# EAGLE design attiny2313devbdtst1 (EAGLE 5.06)
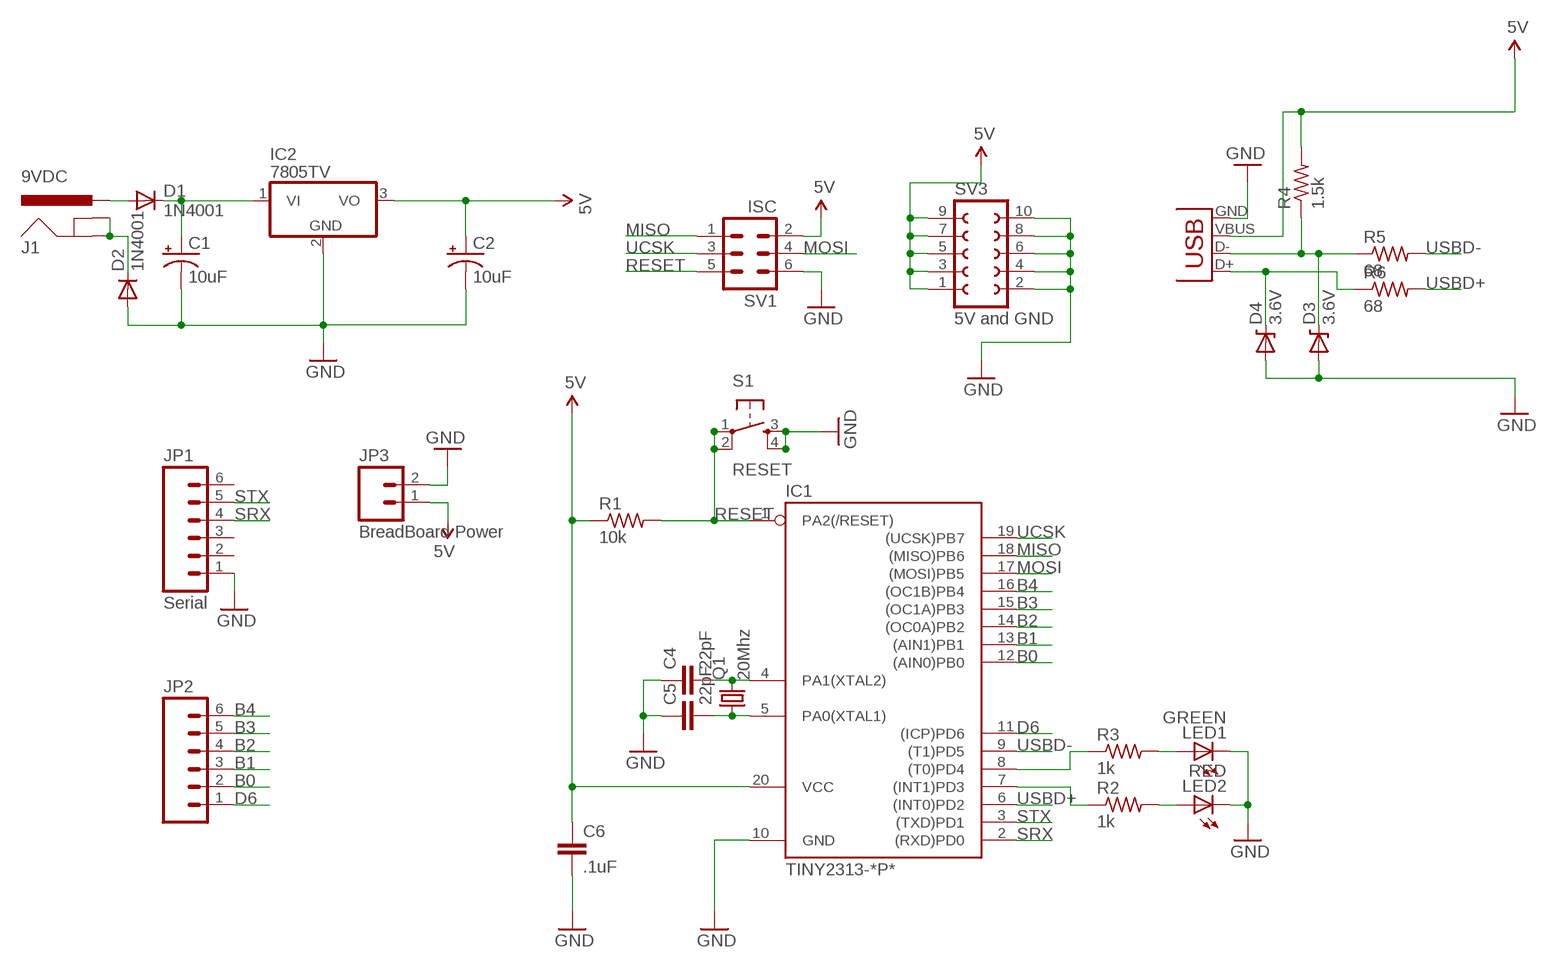
[diagram p0: schematic, sheet 1]

## Parts
C1  10uF  CAP_POLPTH2  [CPOL-RADIAL-10UF-25V]
C2  10uF  CAP_POLPTH2  [CPOL-RADIAL-10UF-25V]
C4  22pF  CAPPTH2  [CAP-PTH-SMALL2]
C5  22pF  CAPPTH2  [CAP-PTH-SMALL2]
C6  .1uF  CAPPTH2  [CAP-PTH-SMALL2]
D1  1N4001  DIODEPTH  [DIODE-1N4001]
D2  1N4001  DIODEPTH  [DIODE-1N4001]
D3  3.6V  DIODE-ZENERPTH  [DIODE-ZENER]
D4  3.6V  DIODE-ZENERPTH  [DIODE-ZENER]
IC1  TINY2313-*P*  [DIL20]
IC2  7805TV  [TO220V]
J1  9VDC  POWER_JACKPTH  [POWER_JACK_PTH]
JP1  Serial  M06SIP  [1X06]
JP2  M06SIP  [1X06]
JP3  BreadBoard Power  M02PTH  [1X02]
LED1  GREEN  LED3MM  [LED3MM]
LED2  RED  LED3MM  [LED3MM]
Q1  20Mhz  CRYSTALHC49UV  [HC49U-V]
R1  10k  R-US_0207/10  [0207/10]
R2  1k  R-US_0207/10  [0207/10]
R3  1k  R-US_0207/10  [0207/10]
R4  1.5k  R-US_0207/10  [0207/10]
R5  68  R-US_0207/10  [0207/10]
R6  68  R-US_0207/10  [0207/10]
S1  RESET  TAC_SWITCHPTH  [TACTILE-PTH]
SV1  ISC  ML6  [ML6]
SV3  5V and GND  FE05-2  [FE05-2]
X1  USBPTH  [USB-B-PTH]

## Nets
5V [5V]: C2.1(+) C6.1 IC1.20(VCC) IC2.3(VO) JP3.1 R1.1 R4.2 SV1.2 SV3.1 SV3.3 SV3.5 SV3.7 SV3.9 X1.VBUS
B0: IC1.12((AIN0)PB0) JP2.2
B1: IC1.13((AIN1)PB1) JP2.3
B2: IC1.14((OC0A)PB2) JP2.4
B3: IC1.15((OC1A)PB3) JP2.5
B4: IC1.16((OC1B)PB4) JP2.6
D6: IC1.11((ICP)PD6) JP2.1
GND [GND]: C1.2(-) C2.2(-) C4.1 C5.1 C6.2 D2.A D3.P$2(A) D4.P$2(A) IC1.10(GND) IC2.2(GND) JP1.1 JP3.2 LED1.K(C) LED2.K(C) S1.3 S1.4 SV1.6 SV3.2 SV3.4 SV3.6 SV3.8 SV3.10 X1.GND
MISO: IC1.18((MISO)PB6) SV1.1
MOSI: IC1.17((MOSI)PB5) SV1.4
N$1: D1.A J1.PWR
N$2: C1.1(+) D1.C IC2.1(VI)
N$3: D2.C J1.GND J1.GNDBREAK
N$4: IC1.8((T0)PD4) R3.1
N$5: IC1.7((INT1)PD3) R2.1
N$6: C4.2 IC1.4(PA1(XTAL2)) Q1.2
N$7: C5.2 IC1.5(PA0(XTAL1)) Q1.1
N$8: LED2.A R2.2
N$9: LED1.A R3.2
N$10: D3.P$1(C) R4.1 R5.1 X1.D-
N$11: D4.P$1(C) R6.1 X1.D+
RESET: IC1.1(PA2(/RESET)) R1.2 S1.1 S1.2 SV1.5
SRX: IC1.2((RXD)PD0) JP1.4
STX: IC1.3((TXD)PD1) JP1.5
UCSK: IC1.19((UCSK)PB7) SV1.3
USBD+: IC1.6((INT0)PD2) R6.2
USBD-: IC1.9((T1)PD5) R5.2
Unconnected: JP1.2 JP1.3 JP1.6

## Library data of the parts
C1 C2 = SparkFun:CAP_POL: Capacitor Polarized These are standard SMD and PTH capacitors. Normally 10uF, 47uF, and 100uF in electrolytic and tantalum varieties. Always verify the external diameter of the through hole cap, it varies with capacity, voltage, and manufacturer. The EIA devices should be standard.
C4-C6 = SparkFun:CAP: Capacitor Standard 0603 ceramic capacitor, and 0.1" leaded capacitor.
D1 D2 = SparkFun:DIODE: Diode These are standard reverse protection diodes and small signal diodes. SMA package can handle up to about 1A. SOD-323 can handle about 200mA. What the SOD-323 package when ordering, there are some mfgs out there that are 5-pin packages.
D3 D4 = SparkFun:DIODE-ZENER: Zener Diode Production Part - 8199 3.4V Zener Voltage
IC1 = avr-6:TINY2313*: Atmel Tiny2313 2K Flash, 128 bytes EEPROM, 128 bytes RAM
IC2 = linear:78*: Positive VOLTAGE REGULATOR Source: http://cache.national.com/ds/LM/LM78L05.pdf http://www.fairchildsemi.com/ds/LM/LM7805.pdf
J1 = SparkFun:POWER_JACK: Power Jack This is the standard 5.5mm barrel jack for power. The PTH is the most common, proven, reliable, footprint. All others are experimental. The Slot footprint only works if the mill layer is transmitted to the PCB fab house so be warned. Spark Fun Electronics SKU : PRT-00119. Mating wall wart : TOL-00298 (and others)
JP1 JP2 = SparkFun:M06: Header 6 Standard 6-pin 0.1" header. Use with straight break away headers (SKU : PRT-00116), right angle break away headers (PRT-00553), swiss pins (PRT-00743), machine pins (PRT-00117), and female headers (PRT-00115). Molex polarized connector foot print use with SKU : PRT-08094 with associated crimp pins and housings. NOTES ON THE VARIANTS LOCK and LOCK_LONGPADS... This footprint was designed to help hold the alignment of a through-hole component (i.e. 6-pin header) while soldering it into place. You may notice that each hole has been shifted either up or down by 0.005 of an inch from it's more standard position (which is a perfectly straight line). This slight alteration caused the pins (the squares in the middle) to touch the edges of the holes. Because they are alternating, it causes a "brace" to hold the component in place. 0.005 has proven to be the perfect amount of "off-center" position when using our standard breakaway headers. Although looks a little odd when you look at the bare footprint, once you have a header in there, the alteration is very hard to notice. Also, if you push a header all the way into place, it is covered up entirely on the bottom side. This idea of altering the position of holes to aid alignment will be further integrated into the Sparkfun Library for other footprints. It can help hold any component with 3 or more connection pins.
JP3 = SparkFun:M02: Header 2 Standard 2-pin 0.1" header. Use with straight break away headers (SKU : PRT-00116), right angle break away headers (PRT-00553), swiss pins (PRT-00743), machine pins (PRT-00117), and female headers (PRT-00115). Molex polarized connector foot print use with SKU : PRT-08233 with associated crimp pins and housings.
LED1 LED2 = SparkFun:LED: LEDs Standard schematic elements and footprints for 5mm, 3mm, 1206, and 0603 sized LEDs. 5mm - Spark Fun Electronics SKU : COM-00529 (and others)
Q1 = SparkFun:CRYSTAL: Crystals Various standard crystals. Proven footprints. Spark Fun Electronics SKU : COM-00534
R1-R6 = resistor:R-US_: RESISTOR, American symbol
S1 = SparkFun:TAC_SWITCH: Momentary Switch Button commonly used for reset or general input. Spark Fun Electronics SKU : COM-00097
SV1 = con-harting-ml:ML6: HARTING
SV3 = con-lsta:FE05-2: FEMALE HEADER
X1 = SparkFun:USB: USB Connectors USB-B-PTH is fully proven SKU : PRT-00139 USB-miniB is fully proven SKU : PRT-00587 USB-A-PCB is untested. USB-A-H is throughly reviewed, but untested. Spark Fun Electronics SKU : PRT-00437 USB-B-SMT is throughly reviewed, but untested. Needs silkscreen touching up. USB-A-S has not been used/tested USB-MB-H has not been used/tested

## Net classes
1 5V: width 0.012 mm
2 GND: width 0.012 mm

## Board
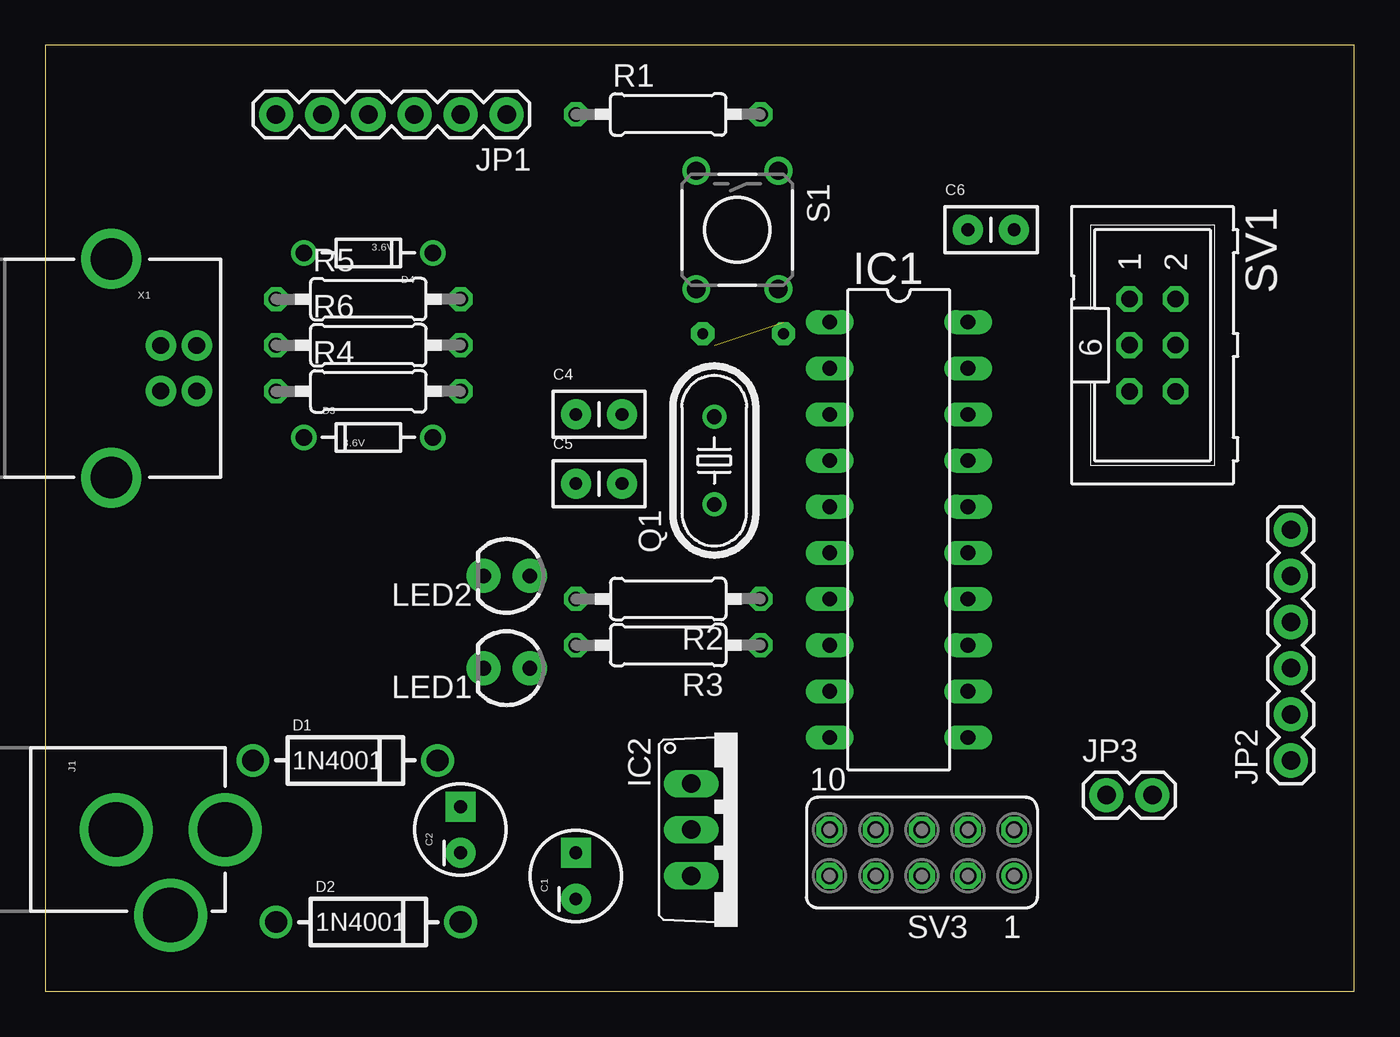
[diagram p1: board, top side]
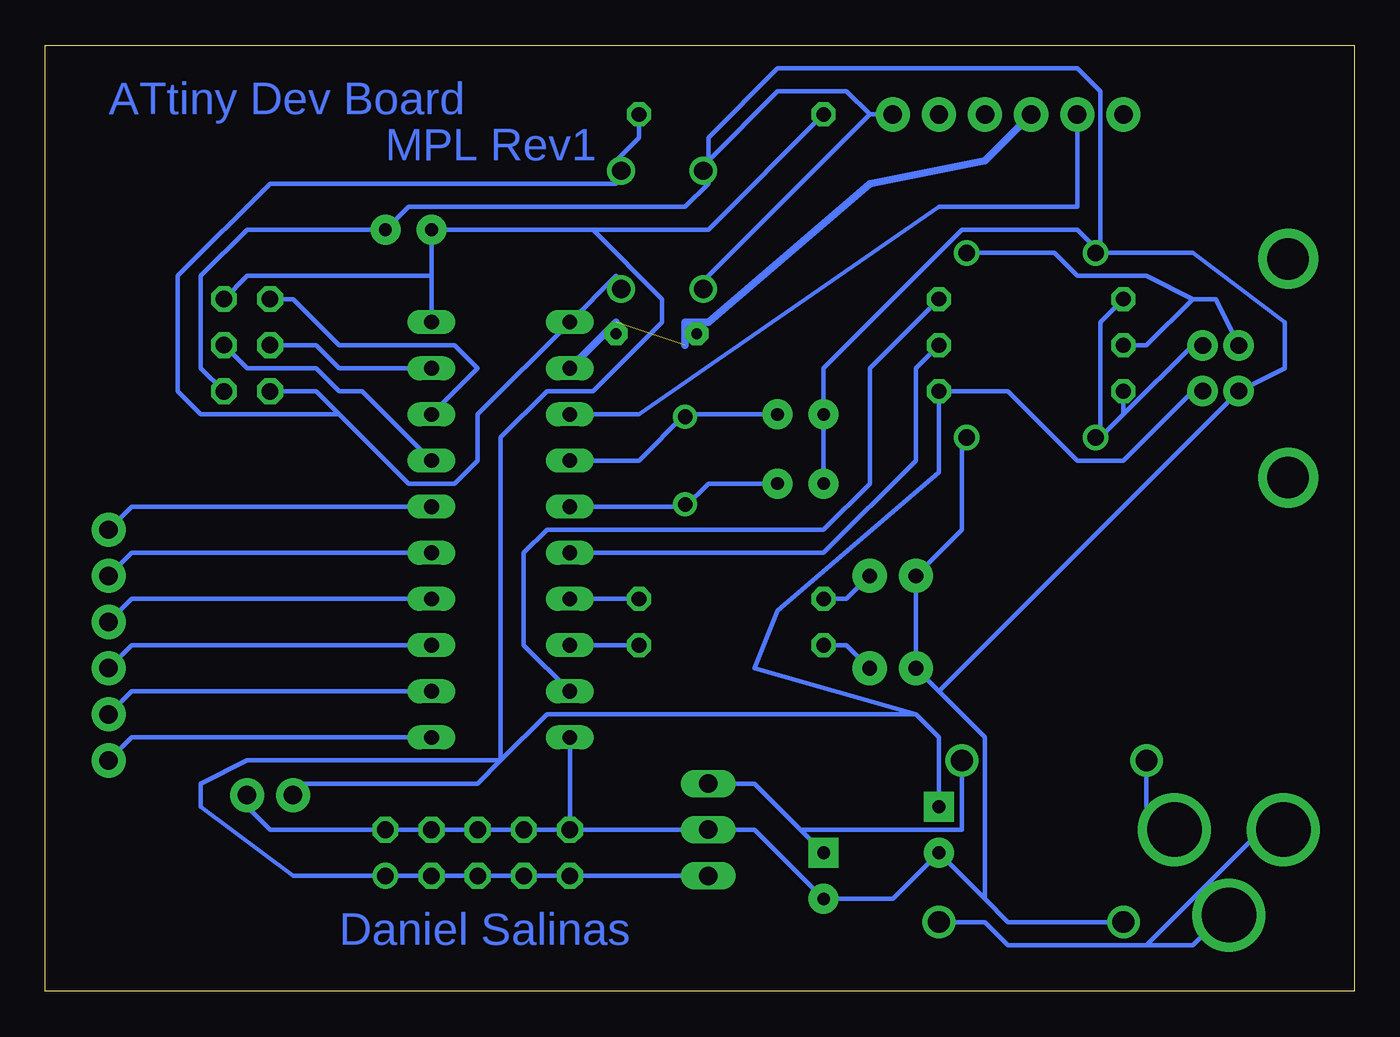
[diagram p2: board, bottom side, seen from below]

Size 72.06 x 52.06 mm. Coordinates in mm from the lower left corner, seen from the top.
Outline: 0,0 72.06,0 72.06,52.06 0,52.06 0,0
Copper layers (1*16): Top 0.035mm / dielectric 1.5mm / Bottom 0.035mm
Design rules "default *": minimum track width 10mil, minimum drill 24mil, track to track 8mil, track to pad 8mil, pad to pad 8mil, via to via 8mil, smd to smd 8mil, copper to edge 40mil, drill to drill 8mil, minimum pad ring 10mil, minimum via ring 8mil, stop-mask expansion 4mil, vias tented up to drill 0mil, thermal gap 10mil

### Footprints (pad centres in the part's own frame; a part is rotated, then mirrored left to right if it is on the bottom)
CPOL-RADIAL-10UF-25V = drill 0.7 pad 1.651 square: 1 1.27,0 | drill 0.7 pad 1.651 round: 2 -1.27,0
CAP-PTH-SMALL2 = drill 0.7 pad 1.651 round: 1 0,0; 2 2.54,0
DIODE-1N4001 = drill 1.2 round: A -5.08,0; C 5.08,0
DIODE-ZENER = drill 0.9 round: P$1 -3.556,0; P$2 3.556,0
DIL20 = drill 0.813 long: 1 -11.43,-3.81; 2 -8.89,-3.81; 3 -6.35,-3.81; 4 -3.81,-3.81; 5 -1.27,-3.81; 6 1.27,-3.81; 7 3.81,-3.81; 8 6.35,-3.81; 9 8.89,-3.81; 10 11.43,-3.81; 11 11.43,3.81; 12 8.89,3.81; 13 6.35,3.81; 14 3.81,3.81; 15 1.27,3.81; 16 -1.27,3.81; 17 -3.81,3.81; 18 -6.35,3.81; 19 -8.89,3.81; 20 -11.43,3.81
TO220V = drill 1.016 long: 1 -2.54,-2.54; 2 0,-2.54; 3 2.54,-2.54
POWER_JACK_PTH = drill 2.997 round: GND 0,7.7; GNDBREAK 4.7,10.7; PWR 0,13.7
1X06 = drill 1.016 pad 1.88 round: 1 0,0; 2 2.54,0; 3 5.08,0; 4 7.62,0; 5 10.16,0; 6 12.7,0
1X02 = drill 1.016 pad 1.88 round: 1 0,0; 2 2.54,0
LED3MM = drill 0.813 pad 1.88 round: A -1.27,0; K 1.27,0
HC49U-V = drill 0.813 round: 1 -2.413,0; 2 2.413,0
0207/10 = drill 0.813 octagon: 1 -5.08,0; 2 5.08,0
TACTILE-PTH = drill 1.016 round: 1 -3.251,2.261; 2 3.251,2.261; 3 -3.251,-2.261; 4 3.251,-2.261
ML6 = drill 0.914 octagon: 1 -2.54,-1.27; 2 -2.54,1.27; 3 0,-1.27; 4 0,1.27; 5 2.54,-1.27; 6 2.54,1.27
FE05-2 = drill 0.914 round: 1 -5.08,1.27 | drill 0.914 octagon: 2 -5.08,-1.27; 3 -2.54,1.27; 4 -2.54,-1.27; 5 0,1.27; 6 0,-1.27; 7 2.54,1.27; 8 2.54,-1.27; 9 5.08,1.27; 10 5.08,-1.27
USB-B-PTH = drill 0.914 pad 1.676 round: D+ 0,1.25; D- 1.981,1.25; GND 0,-1.25; VBUS 1.981,-1.25 | drill 2.286 round: P$1 -2.718,-6.02; P$2 -2.718,6.02

### Placement (x,y rotation side)
C1  29.21,6.35 90 top
C2  22.86,8.89 90 top
C4  29.21,31.75 0 top
C5  29.21,27.94 0 top
C6  50.8,41.91 0 top
D1  16.51,12.7 0 top
D2  17.78,3.81 0 top
D3  17.78,30.48 0 top
D4  17.78,40.64 180 top
IC1  46.99,25.4 270 top
IC2  38.1,8.89 270 top
J1  -3.81,8.89 270 top
JP1  25.4,48.26 180 top
JP2  68.58,12.7 90 top
JP3  58.42,10.79 0 top
LED1  25.4,17.78 180 top
LED2  25.4,22.86 180 top
Q1  36.83,29.21 90 top
R1  34.29,48.26 0 top
R2  34.29,21.59 180 top
R3  34.29,19.05 180 top
R4  17.78,33.02 0 top
R5  17.78,38.1 0 top
R6  17.78,35.56 0 top
S1  38.1,41.91 270 top
SV1  60.96,35.56 270 top
SV3  48.26,7.62 180 top
X1  6.35,34.29 0 top

### Tracks (layer width: path | path; a pad name or v marks a point on that pad's centre or on a via)
5V
  Bottom 0.254: R1.1 35.56,41.91 41.91,41.91 | 41.91,41.91 C6.1 50.8,39.37 | 50.8,39.37 IC1.20 | SV1.2 60.96,39.37 50.8,39.37 | IC2.3 SV3.9 SV3.7 SV3.5 SV3.3 SV3.1 58.42,6.35 63.5,10.16 63.5,11.43 60.96,12.7 46.99,12.7 | X1.VBUS 8.89,33.02 12.7,29.21 15.24,29.21 19.05,33.02 R4.2 22.86,28.58 31.75,20.95 33.02,17.78 24.13,15.24 | C2.1 22.86,13.97 24.13,15.24 | 46.99,12.7 44.45,15.24 24.13,15.24 | 46.99,12.7 48.26,11.43 58.42,11.43 JP3.1 | 41.91,41.91 38.1,38.1 38.1,36.83 41.91,33.02 44.45,33.02 46.99,30.48 46.99,12.7
B0
  Bottom 0.254: IC1.12 67.31,16.51 JP2.2
B1
  Bottom 0.254: IC1.13 67.31,19.05 JP2.3
B2
  Bottom 0.254: IC1.14 67.31,21.59 JP2.4
B3
  Bottom 0.254: IC1.15 67.31,24.13 JP2.5
B4
  Bottom 0.254: IC1.16 67.31,26.67 JP2.6
D6
  Bottom 0.254: IC1.11 67.31,13.97 JP2.1
GND
  Bottom 0.254: SV1.6 63.5,34.29 63.5,39.37 60.96,41.91 C6.2 52.07,43.18 36.83,43.18 35.56,44.45 S1.3 35.56,45.72 | 26.67,48.26 35.56,39.37 S1.4 | 26.67,48.26 JP1.1 | 35.56,45.72 31.75,49.53 27.94,49.53 26.67,48.26 | C5.1 C4.1 29.21,34.29 21.59,41.91 15.24,41.91 13.97,40.64 | 13.97,40.64 8.89,40.64 3.81,36.83 3.81,34.29 6.35,33.02 | SV3.10 IC1.10 | SV3.10 SV3.8 SV3.6 SV3.4 SV3.2 59.69,8.89 60.96,10.16 JP3.2 | SV3.10 IC2.2 33.02,8.89 C1.2 25.4,5.08 C2.2 20.32,5.08 | D3.P$2 21.59,30.48 21.59,25.4 LED2.K LED1.K 22.86,16.51 | D2.A 19.05,3.81 20.32,5.08 | 22.86,16.51 20.32,13.97 20.32,5.08 | 22.86,16.51 6.35,33.02 | 6.35,33.02 X1.GND | 35.56,45.72 35.56,46.99 31.75,50.8 15.24,50.8 13.97,49.53 13.97,40.64 | 13.97,40.64 D4.P$2
MISO
  Bottom 0.254: IC1.18 48.26,34.29 49.53,35.56 55.88,35.56 58.42,38.1 SV1.1
MOSI
  Bottom 0.254: IC1.17 54.61,33.02 55.88,33.02 57.15,34.29 60.96,34.29 SV1.4
N$1
  Bottom 0.254: D1.A 11.43,10.16 10.16,8.89 J1.PWR
N$2
  Bottom 0.254: IC2.1 33.02,11.43 30.48,8.89 | 30.48,8.89 C1.1 | D1.C 21.59,8.89 30.48,8.89
N$3
  Bottom 0.254: D2.C 20.32,3.81 19.05,2.54 11.43,2.54 | 11.43,2.54 8.89,2.54 7.62,3.81 J1.GNDBREAK | 11.43,2.54 5.08,8.89 J1.GND
N$4
  Bottom 0.254: R3.1 IC1.8
N$5
  Bottom 0.254: R2.1 IC1.7
N$6
  Bottom 0.254: IC1.4 39.37,29.21 36.83,31.75 | C4.2 36.83,31.75 | 36.83,31.75 Q1.2
N$7
  Bottom 0.254: 36.83,26.67 IC1.5 | C5.2 35.56,27.94 36.83,26.67 | 36.83,26.67 Q1.1
N$8
  Bottom 0.254: R2.2 27.94,21.59 LED2.A
N$9
  Bottom 0.254: R3.2 27.94,19.05 LED1.A
N$10
  Bottom 0.254: 12.7,31.75 R4.1 | 13.97,30.48 12.7,31.75 | R5.1 13.97,36.83 13.97,30.48 | D3.P$1 13.97,30.48 | 12.7,31.75 8.89,35.56 X1.D-
N$11
  Bottom 0.254: R6.1 11.43,35.56 8.89,38.1 | 8.89,38.1 7.62,38.1 6.35,35.56 X1.D+ | 8.89,38.1 11.43,39.37 15.24,39.37 16.51,40.64 D4.P$1 21.59,40.64
N$12  (via drill 0.6 pad 1.27)
  other vias: 40.64,36.2
N$13  (via drill 0.6 pad 1.27)
  other vias: 36.19,36.2
RESET
  Bottom 0.254: R1.2 39.37,46.99 40.64,45.72 S1.1 40.64,44.45 59.69,44.45 64.77,39.37 64.77,33.02 63.5,31.75 55.88,31.75 | S1.2 40.64,39.37 IC1.1 48.26,31.75 48.26,29.21 49.53,27.94 52.07,27.94 55.88,31.75 | SV1.5 57.15,33.02 55.88,31.75
SRX  (1 unrouted)
  Bottom 0.406: JP1.4 20.32,45.72 26.67,44.45 35.56,36.83 36.83,36.83 36.83,35.56 | IC1.2 40.64,36.83
STX
  Bottom 0.254: IC1.3 39.37,31.75 22.86,43.18 15.24,43.18 JP1.5
UCSK
  Bottom 0.254: IC1.19 55.88,34.29 57.15,35.56 SV1.3
USBD+
  Bottom 0.254: IC1.6 29.21,24.13 24.13,29.21 24.13,34.29 R6.2
USBD-
  Bottom 0.254: IC1.9 45.72,19.05 45.72,24.13 44.45,25.4 29.21,25.4 26.67,27.94 26.67,34.29 R5.2

### Text on the board
Bottom: ATtiny Dev Board | MPL Rev1 | Daniel Salinas
_tsilk: RST | ISP | RX | TX | GND | D6 B0 B1 B2 B3 B4 | 5V